# EAGLE design splitter (EAGLE 8.2.2)
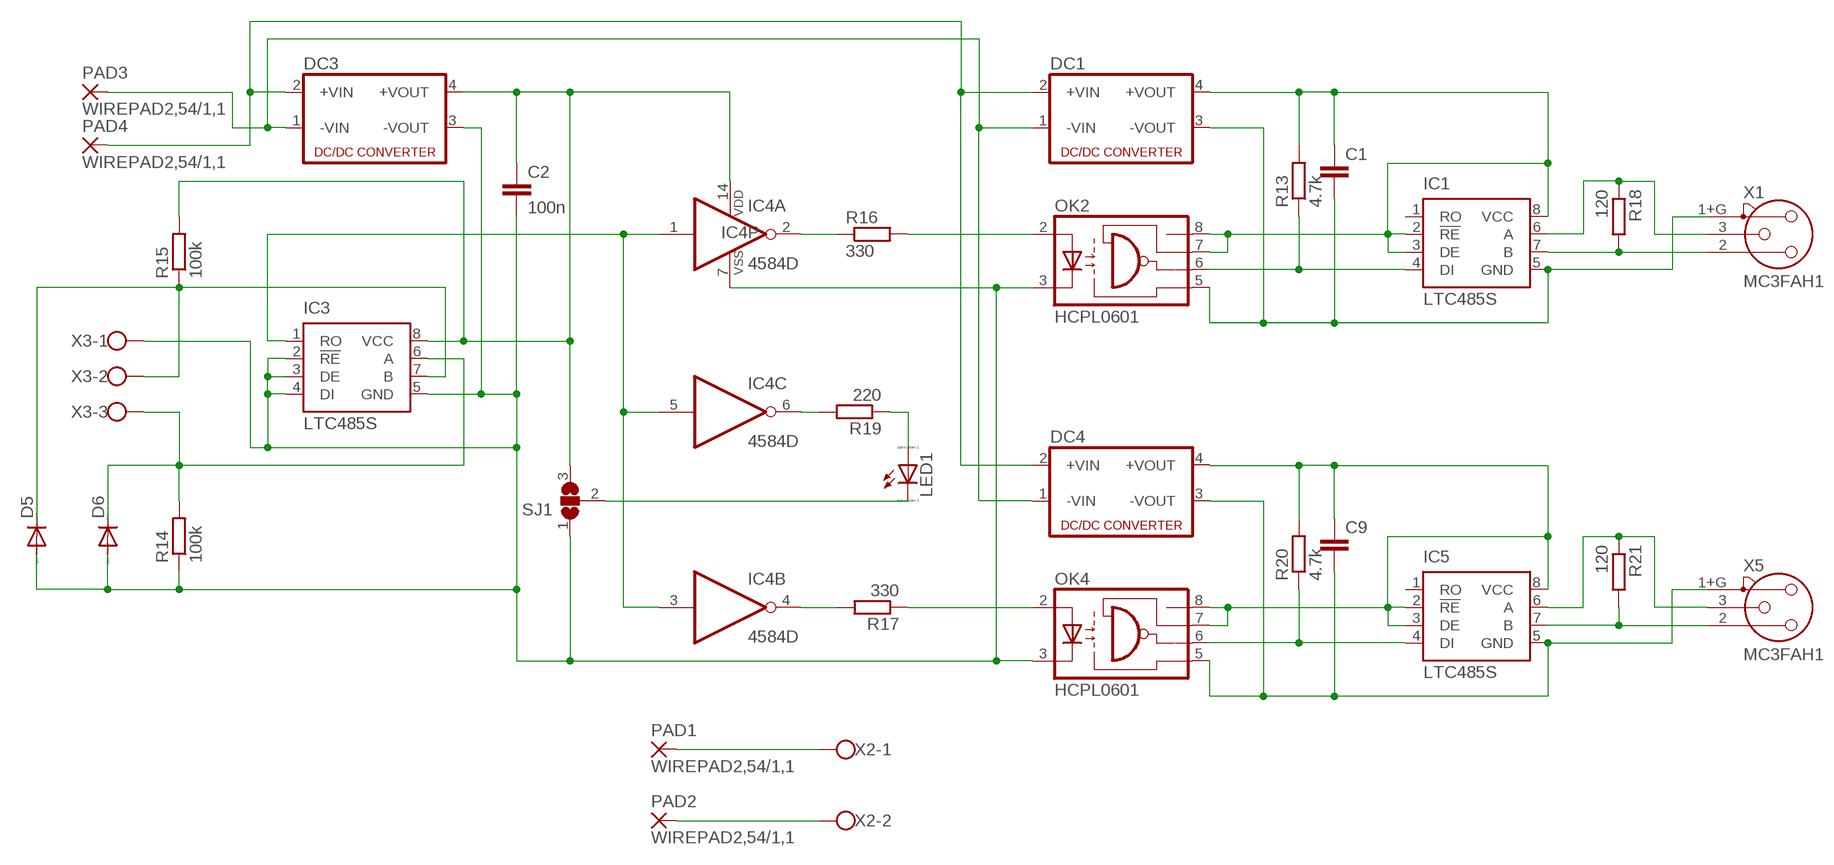
[diagram p0: schematic, sheet 1]

## Parts
C1  C-EUC1206K  [C1206K]
C2  100n  C-EUC1206K  [C1206K]
C9  C-EUC1206K  [C1206K]
D5  DIODE-SOD80C  [SOD80C]
D6  DIODE-SOD80C  [SOD80C]
DC1  NME  [NME]
DC3  NME  [NME]
DC4  NME  [NME]
IC1  LTC485S  [SOIC8]
IC3  LTC485S  [SOIC8]
IC4  4584D  [SO14]
IC5  LTC485S  [SOIC8]
LED1  LED_E  [LED_1206]
OK2  HCPL0601  [SOIC08]
OK4  HCPL0601  [SOIC08]
PAD1  WIREPAD2,54/1,1  [2,54/1,1]
PAD2  WIREPAD2,54/1,1  [2,54/1,1]
PAD3  WIREPAD2,54/1,1  [2,54/1,1]
PAD4  WIREPAD2,54/1,1  [2,54/1,1]
R13  4.7k  R-EU_M1206  [M1206]
R14  100k  R-EU_M1206  [M1206]
R15  100k  R-EU_M1206  [M1206]
R16  330  R-EU_M1206  [M1206]
R17  330  R-EU_M1206  [M1206]
R18  120  R-EU_M1206  [M1206]
R19  220  R-EU_M1206  [M1206]
R20  4.7k  R-EU_M1206  [M1206]
R21  120  R-EU_M1206  [M1206]
SJ1  SJ2W  [SJ_2]
X1  MC3FAH1  [NC3FAH1]
X2  W237-102  [W237-102]
X3  W237-103  [W237-103]
X5  MC3FAH1  [NC3FAH1]

## Nets
N$1: LED1.C SJ1.2
N$2: IC1.6(A) R18.1 X1.3
N$3: IC5.7(B) R21.2 X5.2
N$4: IC1.4(DI) OK2.6(VO) R13.1
N$6: C1.1 DC1.4(+VOUT) IC1.2(!RE) IC1.3(DE) IC1.8(VCC) OK2.7(VE) OK2.8(VCC) R13.2
N$7: IC5.6(A) R21.1 X5.3
N$8: IC5.4(DI) OK4.6(VO) R20.1
N$9: C9.2 DC4.3(-VOUT) IC5.5(GND) OK4.5(GND) X5.1+G
N$10: C9.1 DC4.4(+VOUT) IC5.2(!RE) IC5.3(DE) IC5.8(VCC) OK4.7(VE) OK4.8(VCC) R20.2
N$11: IC4.2(A:O) R16.1
N$12: OK2.2(A) R16.2
N$13: IC4.4(B:O) R17.2
N$14: OK4.2(A) R17.1
N$15: IC3.1(RO) IC4.1(A:I) IC4.3(B:I) IC4.5(C:I)
N$16: D6.C IC3.6(A) R14.2 X3.3
N$17: IC1.7(B) R18.2 X1.2
N$18: C2.1 DC3.4(+VOUT) IC3.8(VCC) IC4.14(P:VDD) R15.2 SJ1.3
N$19: C2.2 D5.A D6.A DC3.3(-VOUT) IC3.2(!RE) IC3.3(DE) IC3.4(DI) IC3.5(GND) IC4.7(P:VSS) OK2.3(C) OK4.3(C) R14.1 SJ1.1 X3.1
N$20: D5.C IC3.7(B) R15.1 X3.2
N$21: IC4.6(C:O) R19.2
N$22: DC1.1(-VIN) DC3.1(-VIN) DC4.1(-VIN) PAD3.1(P)
N$23: DC1.2(+VIN) DC3.2(+VIN) DC4.2(+VIN) PAD4.1(P)
N$24: PAD2.1(P) X2.2
N$25: PAD1.1(P) X2.1
N$26: LED1.A R19.1
N$27: C1.2 DC1.3(-VOUT) IC1.5(GND) OK2.5(GND) X1.1+G
Unconnected: IC1.1(RO) IC4.8(D:O) IC4.9(D:I) IC4.10(E:O) IC4.11(E:I) IC4.12(F:O) IC4.13(F:I) IC5.1(RO)

## Library data of the parts
C1 C2 C9 = resistor:C-EU: CAPACITOR, European symbol
D5 D6 = diode:DIODE-: DIODE
DC1 DC3 DC4 = dc-dc-converter:NME: DC-DC CONVERTER; MF: C & D TECHNOLOGIES, INC; MPN: NME1205D; OC_FARNELL: 1021466; OC_NEWARK: 98B8198
IC1 IC3 IC5 = linear-technology:LTC485: Low Power RS485 Interface Transceiver Source: http://www.linear.com/pc/downloadDocument.do?navId=H0,C1,C1007,C1017,P2064,D1718; OC_FARNELL: unknown; OC_NEWARK: unknown
IC4 = 45xx:4584: Hex SCHMITT TRIGGER (74C14)
LED1 = eagle-ltspice:LED_E: LED Source: http://www.osram.convergy.de Source: www.luxeon.com Source: www.kingbright.com; SPICEMODEL: NONE; SPICEPREFIX: D; SPICETYPE: diode
OK2 OK4 = optocoupler:HCPL0601: HEWLETT PACKARD OPTO COUPLER; MF: AGILENT TECHNOLOGIES; MPN: HCPL-0601-000E; OC_FARNELL: 9995102; OC_NEWARK: 88H7776
PAD1-PAD4 = wirepad:WIREPAD: Wire PAD connect wire on PCB
R13-R21 = resistor:R-EU_: RESISTOR, European symbol
SJ1 = jumper:SJ2W: SMD solder JUMPER
X1 X5 = con-neutrik_ag:MC3?: Neutrik Audio Connector XLR SERIES Stereo 1/4" jack Source: www.neutrik.com/; OC_FARNELL: unknown; OC_NEWARK: unknown
X2 = con-wago-500:W237-102: WAGO SCREW CLAMP; MPN: 237-102; OC_FARNELL: unknown; OC_NEWARK: 70K9898
X3 = con-wago-500:W237-103: WAGO SCREW CLAMP; MPN: 237-103; OC_FARNELL: unknown; OC_NEWARK: 18M7116

## Board
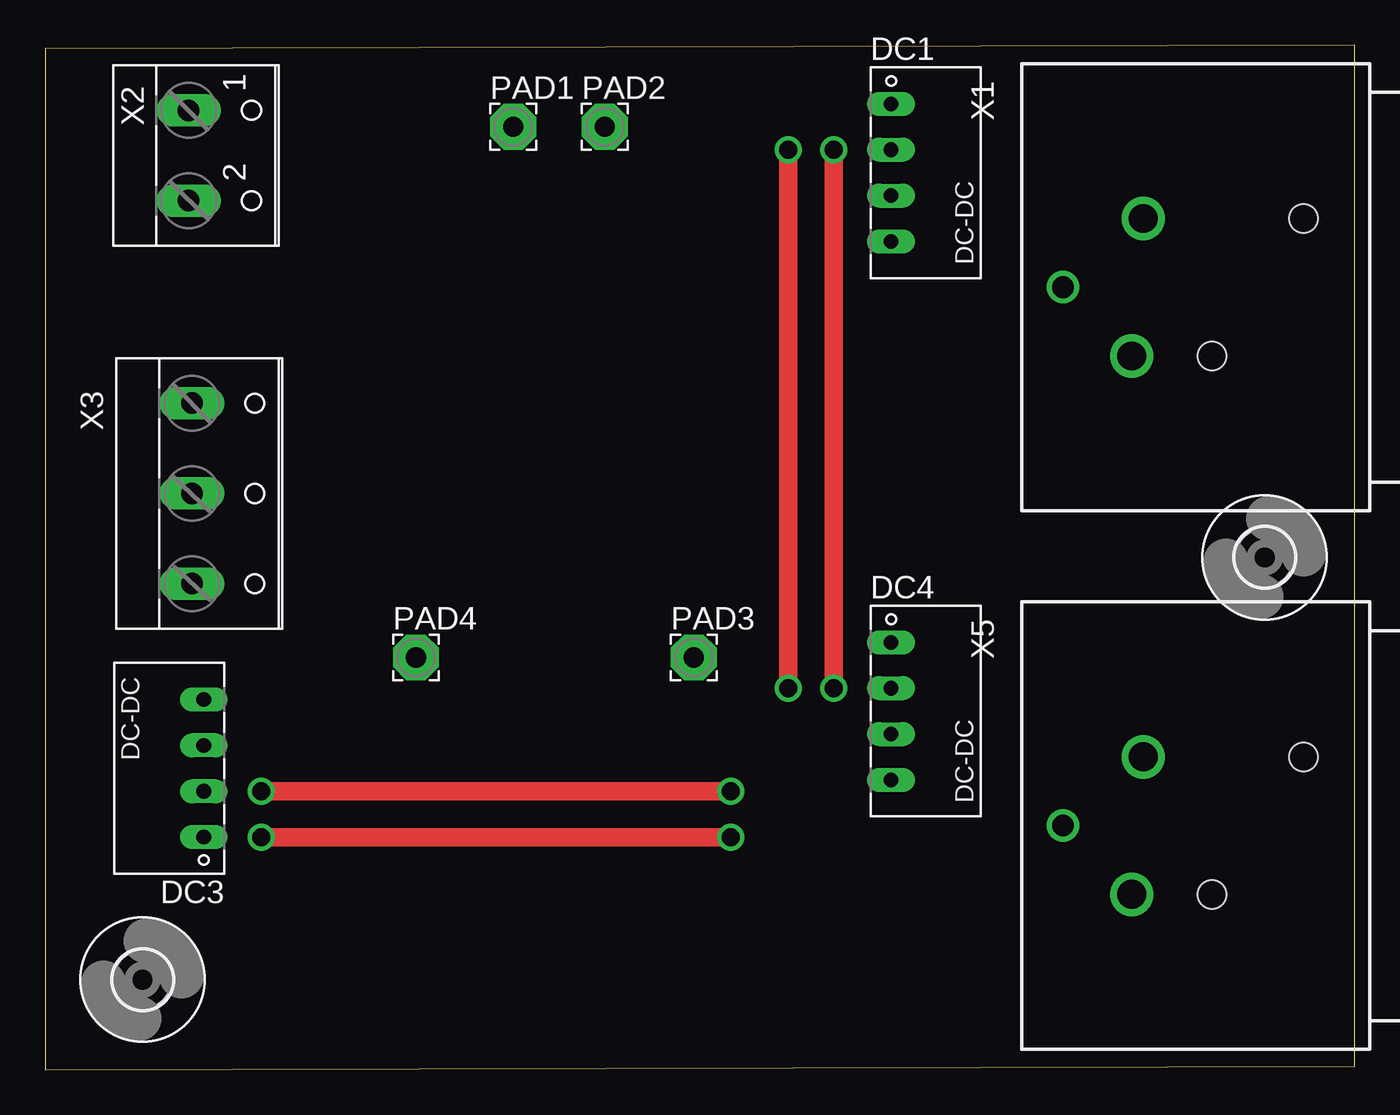
[diagram p1: board, top side]
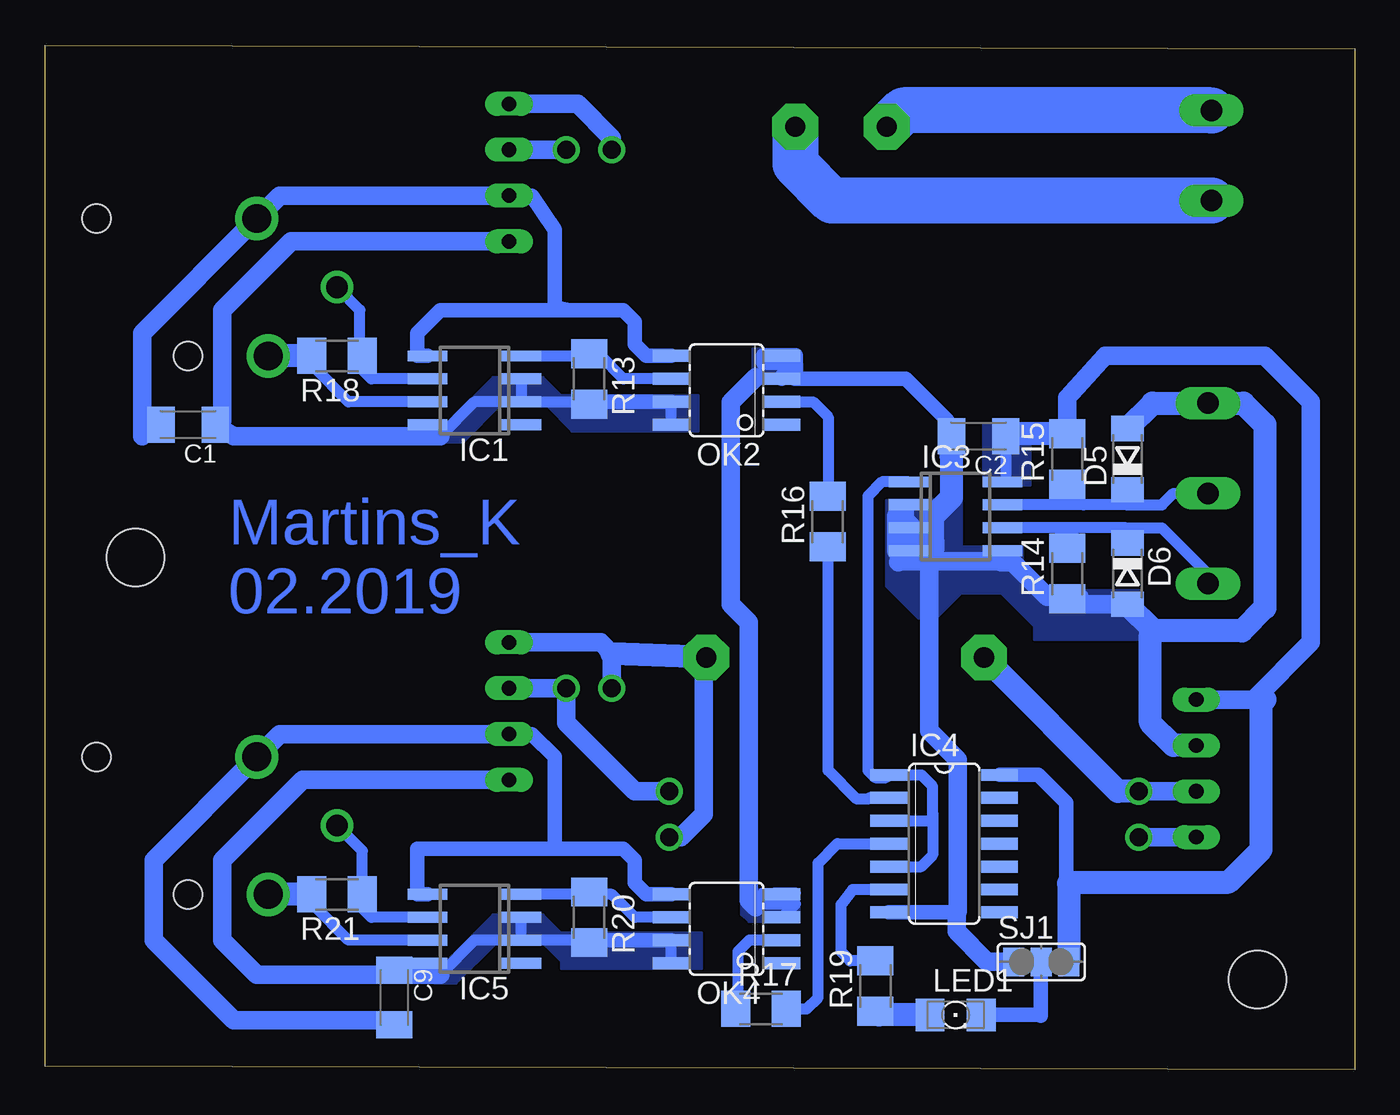
[diagram p2: board, bottom side, seen from below]

Size 72.6 x 56.8 mm. Coordinates in mm from the lower left corner, seen from the top.
Outline: 0,0 72.6,0.2 72.6,56.8 0,56.6 0,0
Copper layers (1*16): Top 0.035mm / dielectric 1.5mm / Bottom 0.035mm
Design rules "default": minimum track width 6mil, minimum drill 0.35mm, track to track 6mil, track to pad 6mil, pad to pad 6mil, via to via 6mil, smd to smd 6mil, copper to edge 40mil, drill to drill 6mil, minimum pad ring 10mil, minimum via ring 8mil, stop-mask expansion 4mil, vias tented up to drill 0mil, thermal gap 10mil

### Footprints (pad centres in the part's own frame; a part is rotated, then mirrored left to right if it is on the bottom)
C1206K = smd 1.5 x 2: 1 -1.5,0; 2 1.5,0
SOD80C = smd 1.4 x 1.8: A 1.7,0; C -1.7,0
NME = drill 0.813 long: 1 0,3.81; 2 0,1.27; 3 0,-1.27; 4 0,-3.81
SOIC8 = smd 0.6 x 2.2: 1 -1.905,-2.6; 2 -0.635,-2.6; 3 0.635,-2.6; 4 1.905,-2.6; 5 1.905,2.6; 6 0.635,2.6; 7 -0.635,2.6; 8 -1.905,2.6
SO14 = smd 0.66 x 2.032: 1 -3.81,-3.073; 2 -2.54,-3.073; 3 -1.27,-3.073; 4 0,-3.073; 5 1.27,-3.073; 6 2.54,-3.073; 7 3.81,-3.073; 8 3.81,3.073; 9 2.54,3.073; 10 1.27,3.073; 11 0,3.073; 12 -1.27,3.073; 13 -2.54,3.073; 14 -3.81,3.073
LED_1206 = smd 1.6 x 1.803: A -1.422,0; C 1.422,0
SOIC08 = smd 0.66 x 2.032: 1 -1.905,-3.073; 2 -0.635,-3.073; 3 0.635,-3.073; 4 1.905,-3.073; 5 1.905,3.073; 6 0.635,3.073; 7 -0.635,3.073; 8 -1.905,3.073
2,54/1,1 = drill 1.118 pad 2.54 octagon: 1 0,0
M1206 = smd 1.6 x 2: 1 -1.4,0; 2 1.4,0
SJ_2 = smd 1.168 x 1.6: 1 -1.524,0; 2 0,0; 3 1.524,0
3,2 = hole 3.2: 0,0
NC3FAH1 = drill 1.6: 1+G -3.81,0.635; 2 3.81,0 | drill 1.2: 3 0,-3.815 | hole 1.6: -3.81,9.525; 3.81,4.445
W237-102 = drill 1.194 long: 1 -2.5,-1.27; 2 2.5,-1.27
W237-103 = drill 1.194 long: 1 -5,-1.29; 2 0,-1.29; 3 5,-1.29

### Placement (x,y rotation side)
C1  64.68,35.76 180 bottom
C2  20.86,35.12 180 bottom
C9  53.24,4.01 270 bottom
D5  12.61,33.86 90 bottom
D6  12.61,27.5 270 bottom
DC1  46.9,49.73 0 top
DC3  8.8,16.71 180 top
DC4  46.9,19.88 0 top
IC1  48.8,37.67 90 bottom
IC3  22.13,30.68 270 bottom
IC4  22.77,12.54 270 bottom
IC5  48.8,7.82 90 bottom
LED1  22.13,3.05 0 bottom
OK2  34.83,37.67 90 bottom
OK4  34.83,7.82 90 bottom
PAD1  25.94,52.27 0 top
PAD2  31.02,52.27 0 top
PAD3  35.96,22.86 0 top
PAD4  20.55,22.86 0 top
R13  42.45,38.3 270 bottom
R14  15.95,27.5 90 bottom
R15  15.95,33.86 90 bottom
R16  29.23,30.38 90 bottom
R17  32.93,3.38 0 bottom
R18  56.42,39.57 180 bottom
R19  26.58,4.65 90 bottom
R20  42.45,8.46 270 bottom
R21  56.42,9.72 180 bottom
SJ1  17.38,5.98 0 bottom
U$1  [3,2]  67.6,28.4 0 top
U$2  [3,2]  5.4,5 0 top
X1  60.23,43.38 270 top
X2  9.23,50.69 270 top
X3  9.43,31.95 270 top
X5  60.23,13.54 270 top

### Tracks (layer width: path | path; a pad name or v marks a point on that pad's centre or on a via)
N$1
  Bottom 0.813: LED1.C 17.45,3.05 17.4,3 17.4,5.96 SJ1.2
N$2
  Bottom 0.61: X1.3 55.15,42.11 55.15,39.7 | 55.15,39.7 R18.1 | IC1.6 54.52,38.3 55.15,38.94 55.15,39.7
N$3
  Bottom 0.61: IC5.7 55.79,7.19 57.69,9.09 57.69,9.59 R21.2
  Bottom 1.27: R21.2 X5.2
N$4
  Bottom 0.61: IC1.4 42.58,39.57 R13.1 42.32,39.57 41.82,39.57 40.54,38.3 OK2.6
N$6
  Bottom 0.61: IC1.8 51.4,35.19 51.34,35.12 50.71,35.12 48.8,37.03 IC1.2 | IC1.3 IC1.2 | OK2.8 OK2.7 | IC1.2 42.32,37.03
  Bottom 0.813: OK2.7 42.32,37.03 R13.2
  Bottom 1.016: DC1.4 58.96,45.92 62.77,42.11 62.77,35.99 C1.1 62.13,35.12 50.71,35.12
  pour Bottom (no thermals): 36.4,35.4 39.2,35.4 39.2,37.4 36.4,37.4
  pour Bottom (no thermals): 52.4,34.8 49.4,34.8 47.4,36.8 44.8,36.8 43.4,35.4 39,35.4 39,37.4 43.4,37.4 44,37.4 45,38.4 47.8,38.4 50.4,35.8 51.4,35.8
N$7
  Bottom 0.61: X5.3 55.02,12.14 R21.1 55.15,9.59 55.15,9.09 54.52,8.46 IC5.6
N$8
  Bottom 0.61: 42.58,9.72 IC5.4 | 42.58,9.72 R20.1 | OK4.6 39.91,8.46 41.18,9.72 42.58,9.72
N$9
  Bottom 0.813: DC4.3 45.63,18.61 44.35,17.34 44.35,12.26 | IC5.5 51.98,9.72 51.98,12.26 44.35,12.26 | OK4.5 39.27,9.72 39.91,10.36 39.91,11.63 40.54,12.26 44.35,12.26
  Bottom 1.016: DC4.3 59.6,18.61 X5.1+G 66.58,11.63 66.58,7.19 62.13,2.74 53.88,2.74 53.5,2.36 53.4,2.36 C9.2
N$10
  Bottom 0.61: IC5.2 42.58,7.19 R20.2 | IC5.2 IC5.3 | IC5.2 48.8,7.19 50.71,5.28 50.77,5.28 IC5.8 52.84,5.92 C9.1 | OK4.8 OK4.7
  Bottom 0.813: OK4.7 42.58,7.19
  Bottom 1.016: DC4.4 58.32,16.07 62.77,11.63 62.77,7.19 60.87,5.28 50.71,5.28
  pour Bottom (no thermals): 44,5.6 36.2,5.6 36.2,7.6 44,7.6 45,8.6 47.8,8.6 50.4,6 50.6,6 51,5.6 51,4.8 49.8,4.8 47.6,7 45,7 44,6
N$11
  Bottom 0.61: IC4.2 26.93,15.07 27,15 27.6,15 29.2,16.6 29.2,28.95 R16.1
N$12
  Bottom 0.61: OK2.2 30.03,37.03 29.2,36.2 29.2,31.81 R16.2
N$13
  Bottom 0.61: R17.2 30.38,3.38 29.75,4.01 29.75,11.46 28.68,12.54 IC4.4
N$14
  Bottom 0.61: OK4.2 33.56,7.19 34.2,6.55 34.2,3.51 R17.1
N$15
  Bottom 0.61: IC4.5 24.04,11.26 23.4,11.9 23.4,14.24 | 23.4,14.24 23.4,15.71 24.04,16.34 IC4.1 25.98,16.2 26.6,16.2 27,16.6 27,31.8 26.22,32.59 IC3.1 | IC4.3 23.43,13.8 23.4,14.24
N$16
  Bottom 0.61: 16.04,30.04 IC3.6 | 12.68,30.04 16.04,30.04 | 12.68,30.04 10.7,30.04 8.16,27.5 8.16,26.97 X3.3 | R14.2 16.41,28.9 16.31,29.81 15.41,29.41 16.04,30.04 | D6.C 12.61,29.97 12.68,30.04
N$17
  Bottom 0.61: IC1.7 55.79,37.03 57.69,38.94 57.69,39.44 R18.2
  Bottom 1.27: R18.2 X1.2
N$18
  Bottom 0.61: R15.2 15.27,35.12 | C2.1 19.36,32.76 IC3.8
  Bottom 0.813: IC4.14 17.55,16.34 16,14.8 16,10.48 15.86,10.34
  Bottom 1.016: R15.2 15.95,37.27 13.84,39.57 4.98,39.57 2.45,37.03 2.45,23.7 5.62,20.52 | 5.62,20.52 DC3.4 | 4.98,20.52 5.62,20.52
  Bottom 1.27: R15.2 19.23,35.26 C2.1 | SJ1.3 15.86,10.34 15.8,10.4 7,10.4 5.2,12.2 5.2,20.3 4.98,20.52
  pour Bottom (no thermals): 20,35.8 18,35.8 18,32.4 20.6,32.4 20.6,35.8
N$19
  Bottom 0.61: IC3.5 19.53,28.2 19.59,28.14 | 25.3,28.14 25.3,28.77 IC3.4 | IC3.3 IC3.2 | 33.2,38.4 33.1,38.3 OK2.3 | OK4.3 31.75,8.46 31,9.2 32.76,9.2 32.16,9.8 31,9.8 32.8,9.8 33.2,9.4 33.2,9
  Bottom 0.813: 22.36,33.91 22.6,34.15 22.6,36 24.9,38.3 31.05,38.3 31,38.35 31,39.2 | IC4.7 22.08,8.72 22,8.8 | OK2.3 31.76,38.44 31,39.2 | 31,39.2 32.8,39.2 32.8,39.6 31,39.6 31,39.2
  Bottom 1.016: D6.A 15.65,25.8 R14.1 15.27,26.23 17.05,26.23 18.95,28.14 19.59,28.14 | 19.53,28.2 25.25,28.2 25.3,28.14 | 33.2,9 33.6,9.4 33.6,24.8 34.6,25.8 34.6,37 33.2,38.4 | 22,8.8 22,17 22,17.2 23.6,18.8 23.6,29.17 23.4,29.37 | 22.08,8.72 22.08,7.67 20.4,6 18.93,6 SJ1.1
  Bottom 1.27: IC3.4 IC3.3 | D5.A 11.21,36.95 X3.1 6.18,36.95 4.98,35.76 4.98,25.6 6.26,24.33 11.13,24.33 | C2.2 22.36,33.91 22.36,31.72 23.4,30.68 23.4,29.37 23.4,28.77 25.3,30.68 25.3,28.77 | 11.13,24.33 D6.A | DC3.3 10.07,17.98 11.34,19.25 11.34,24.12 11.13,24.33
  pour Bottom (no thermals): 21.8,31.6 21.8,29 18.4,29 18.4,27.6 25.8,27.6 25.8,31.6
  pour Bottom (no thermals): 11.8,23.8 17.8,23.8 17.8,24.6 19.6,26.4 24.6,26.4 25.8,27.6 25.8,28.8 19.2,28.8 17,26.6 11.8,26.6
  pour Bottom (no thermals): 21.6,26.8 21.6,26.6 23.2,25 24.2,25 26,26.8 26,31.6 25.2,31.6 21.6,28
  pour Bottom (no thermals): 30.6,40 30.6,38 33.4,38 33.4,40
  pour Bottom (no thermals): 31,8.2 33.6,8.2 34,8.6 34,10 30.8,10 30.8,8.2
N$20
  Bottom 0.61: 15.04,31.31 IC3.7 | 12.62,31.31 15.04,31.31 | 12.62,31.31 10.7,31.31 10.07,31.95 X3.2 | R15.1 15.15,31.42 15.04,31.31 | D5.C 12.61,31.33 12.62,31.31
N$21
  Bottom 0.61: IC4.6 27.84,9.99 28.48,9.16 28.48,6.55 27.98,6.04 R19.2
N$22  (via drill 1 pad 1.3)
  Top 1.016: v11.97,12.9 v38.01,12.9 | v41.18,51 v41.18,21.15
  Bottom 1.016: DC3.1 v11.97,12.9 | DC1.1 43.09,53.54 41.18,51.64 v41.18,51 | v41.18,21.15 41.18,23.06 41.82,23.7 DC4.1 | v38.01,12.9 37.37,12.9 36.1,14.17 36.1,22.72 PAD3.1
  Bottom 1.27: PAD3.1 41.18,23.06
N$23  (via drill 1 pad 1.3)
  Top 1.016: v43.72,51 v43.72,21.15 | v11.97,15.44 v38.01,15.44
  Bottom 1.016: DC1.2 v43.72,51 | DC4.2 v43.72,21.15 43.72,19.25 39.91,15.44 v38.01,15.44 | DC3.2 v11.97,15.44
  Bottom 1.27: v11.97,15.44 13.13,15.44 PAD4.1
N$24
  Bottom 2.54: X2.2 28.98,48.19 31,50.2 31,52.25 PAD2.1
N$25
  Bottom 2.54: X2.1 25.02,53.19 PAD1.1
N$26
  Bottom 1.27: LED1.A 26.38,3.05 R19.1
N$27
  Bottom 0.813: OK2.5 39.27,39.57 39.91,40.21 39.91,41.48 40.54,42.11 43.56,42.11 | 43.56,42.11 50.71,42.11 51.98,40.84 51.98,39.57 IC1.5 | DC1.3 45.63,48.46 44.35,46.55 44.35,42.27 43.56,42.11
  Bottom 1.016: DC1.3 59.6,48.46 X1.1+G 67.22,40.84 67.22,35.12 C1.2

### Text on the board
Bottom: Martins_K / 02.2019